# Altium project datn_Project.PrjPcb
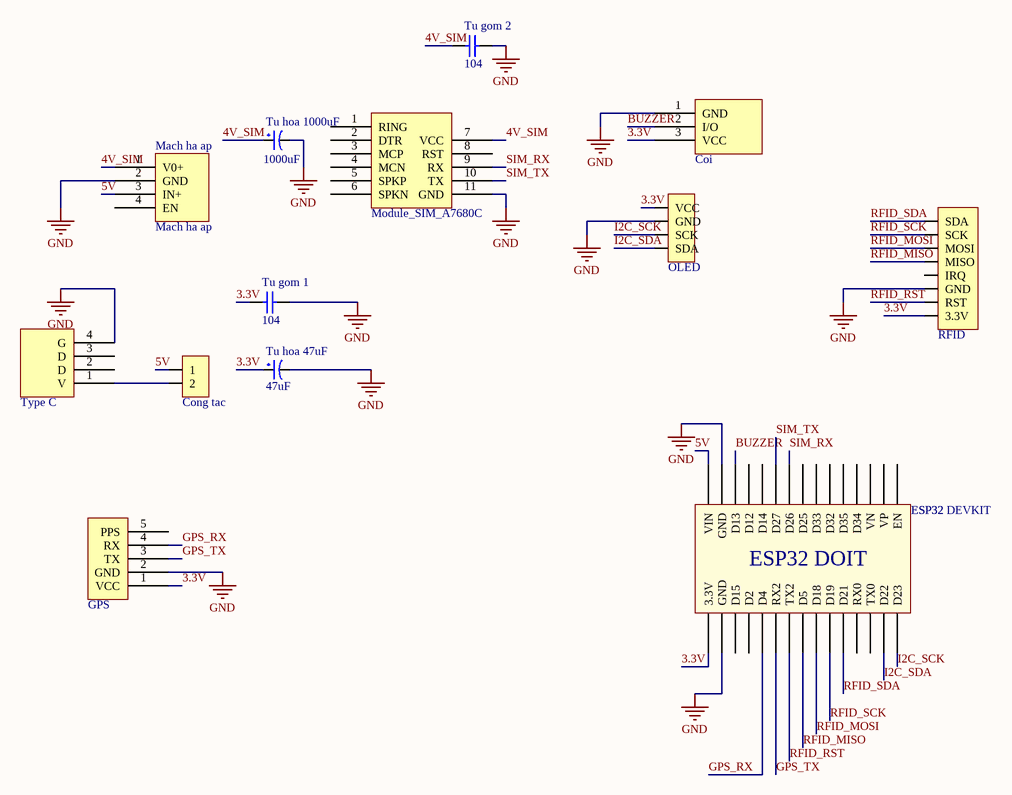
[diagram p0: Datn.SchDoc]
1 sheet, 13 parts. Net scope: global (net labels, ports and power ports of the same name join across sheets).
Board file: Datn.PcbDoc

## Sheet Datn.SchDoc
size A; SheetNumber: 1; SheetTotal: 1

### Parts
Coi  Coi  [Coi]
Cong_tac  Cong tac  [JP 1x2 DT]
ESP32  ESP32 DEVKIT  [ESP32 WROOM 32 KIT]
GPS  GPS  [GPS]
Mach_ha_ap  Mach ha ap  [Mach ha ap]
OLED  OLED  [JP 1x4 DT]
RFID  RFID  [JP 1x8 DT]
Sim  Module_SIM_A7680C  [Footprint_Module_SIM_A7680C]
Tu_gom_1  104  [tu gom]
Tu_gom_2  104  [tu gom]
Tu_hoa_47uF  47uF  [tu hoa 5mm]
Tu_hoa_1000uF  1000uF  [tu hoa 10mm]
Type_C  Type C  [Type C]

### Nets
GND: Coi.1(GND) ESP32.14(GND) ESP32.17(GND) GPS.2(GND) Mach_ha_ap.2(GND) OLED.2(GND) RFID.6(GND) Sim.11(GND) Tu_gom_1.1 Tu_gom_2.1 Tu_hoa_47uF.2 Tu_hoa_1000uF.2 Type_C.4(G)
3.3V: Coi.3(VCC) ESP32.16(3.3V) GPS.1(VCC) OLED.1(VCC) RFID.8(3.3V) Tu_gom_1.2 Tu_hoa_47uF.1
4V_SIM: Mach_ha_ap.1(V0+) Sim.7(VCC) Tu_gom_2.2 Tu_hoa_1000uF.1
5V: Cong_tac.1 ESP32.15(VIN) Mach_ha_ap.3(IN+)
BUZZER: Coi.2(I/O) ESP32.13(D13)
GPS_RX: ESP32.20(D4) GPS.4(RX)
GPS_TX: ESP32.21(RX2) GPS.3(TX)
I2C_SCK: ESP32.30(D23) OLED.3(SCK)
I2C_SDA: ESP32.29(D22) OLED.4(SDA)
RFID_MISO: ESP32.23(D5) RFID.4(MISO)
RFID_MOSI: ESP32.24(D18) RFID.3(MOSI)
RFID_RST: ESP32.22(TX2) RFID.7(RST)
RFID_SCK: ESP32.25(D19) RFID.2(SCK)
RFID_SDA: ESP32.26(D21) RFID.1(SDA)
SIM_RX: ESP32.9(D26) Sim.9(RX)
SIM_TX: ESP32.10(D27) Sim.10(TX)
NetCong_tac_2: Cong_tac.2 Type_C.1(V)

Not connected (* = marked no-connect by the designer): ESP32 1(EN) 2(VP) 3(VN) 4(D34) 5(D35) 6(D32) 7(D33) 8(D25) 11(D14) 12(D12) 18(D15) 19(D2) 27(RX0) 28(TX0); GPS 5(PPS); Mach_ha_ap 4(EN); RFID 5(IRQ); Sim 1(RING) 2(DTR) 3(MCP) 4(MCN) 5(SPKP) 6(SPKN) 8(RST); Type_C 2(D) 3(D)

### Notes on the sheet
- (in symbol ESP32 WROOM 32 KIT) ESP32 DOIT

### Library data of the parts
Cong_tac = JP 1x2 2.54 Duc Thang: Cắm; Ten_Linh_Kien: Jump Đơn Đực 2.54MM 1x40P Thẳng 11MM; Don_Vi: Con; Ma_Hang: MH000903; Ghi_Chu: *; Kieu_Chan: *; Chung_Loai: Cắm
ESP32 = ESP32 WROOM 32 KIT
OLED = JP 1x4 2.54 Duc Thang: Cắm; Ten_Linh_Kien: Jump Đơn Đực 2.54MM 1x40P Thẳng 11MM; Don_Vi: Con; Ma_Hang: MH000903; Ghi_Chu: *; Kieu_Chan: *; Chung_Loai: Cắm
RFID = JP 1x8 2.54 Duc Thang: Cắm; Ten_Linh_Kien: Jump Đơn Đực 2.54MM 1x40P Thẳng 11MM; Don_Vi: Con; Ma_Hang: MH000903; Ghi_Chu: *; Kieu_Chan: *; Chung_Loai: Cắm
Tu_gom_1 Tu_gom_2 = Tu gom 104 50V: Cắm; So_Chan: 2; Ten_Linh_Kien: Tụ gốm 104 100nF 50V; Don_Vi: Con; Ma_Hang: MH004761; Chung_Loai: Cắm; Kieu_Chan: *
Tu_hoa_47uF = Tu Hoa 47uF 25V 5x8: Cắm; Don_Vi: Con; So_Chan: 2; Ten_Linh_Kien: Tụ Hóa 47uF 25V; Ma_Hang: MH006860; Chung_Loai: Cắm; Kieu_Chan: *
Tu_hoa_1000uF = Tu Hoa 6.8uF 400V 10x17: Cắm; Don_Vi: Con; So_Chan: 2; Ten_Linh_Kien: Tụ Hóa 6.8uF 400V 10x17MM; Ma_Hang: MH003745; Chung_Loai: Cắm; Kieu_Chan: *
Type_C = Component_1